# EAGLE design Printrhub_Rev_0.2 (EAGLE 7.5.0)
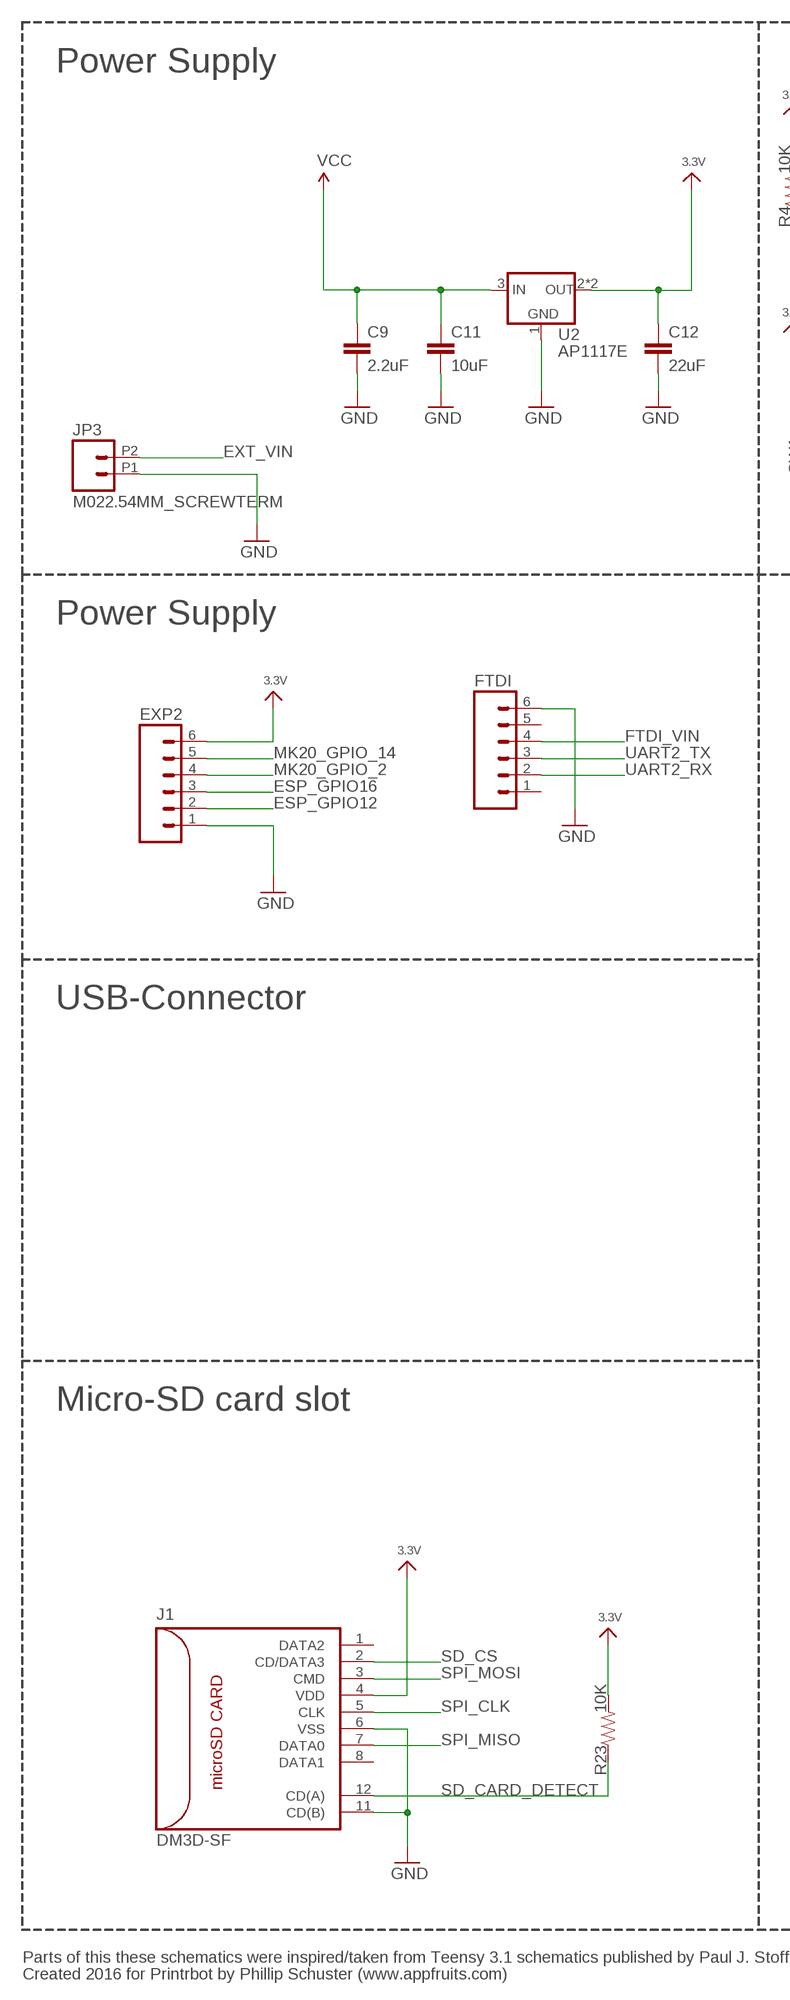
[diagram p0: schematic, sheet 1, part 1 of 2]
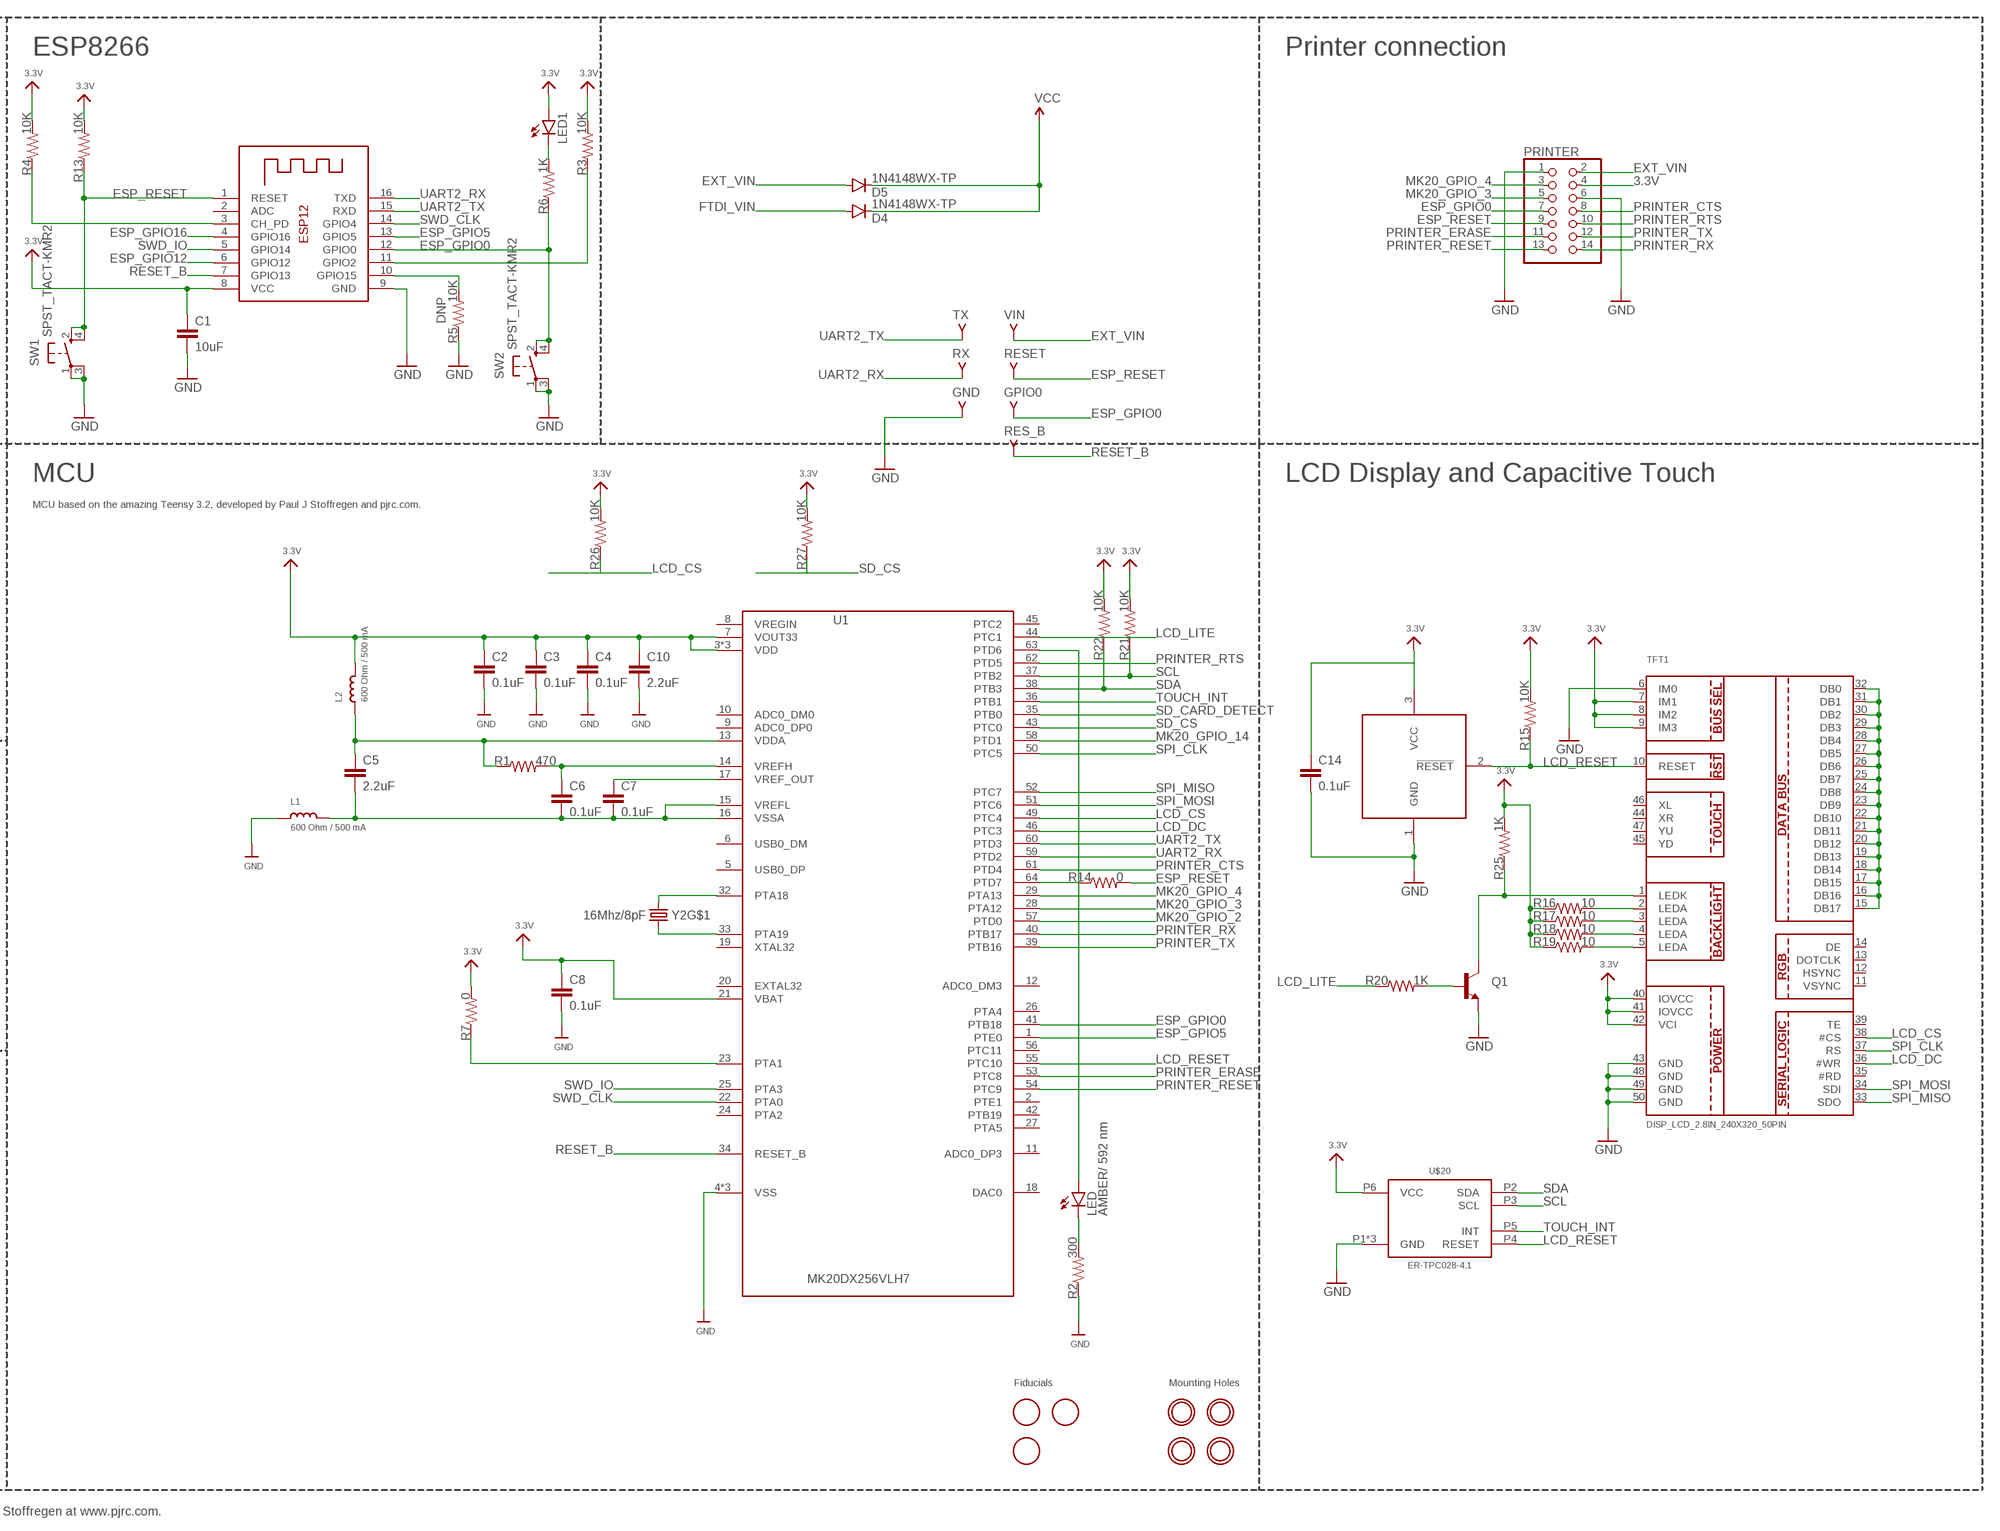
[diagram p1: schematic, sheet 1, part 2 of 2]

## Parts
C1  10uF  CAPACITOR-10UF  [0603-CAP]
C2  0.1uF  CAPACITOR-0.1UF  [0603-CAP]
C3  0.1uF  CAPACITOR-0.1UF  [0603-CAP]
C4  0.1uF  CAPACITOR-0.1UF  [0603-CAP]
C5  2.2uF  CAPACITOR-2.2UF  [0603-CAP]
C6  0.1uF  CAPACITOR-0.1UF  [0603-CAP]
C7  0.1uF  CAPACITOR-0.1UF  [0603-CAP]
C8  0.1uF  CAPACITOR-0.1UF  [0603-CAP]
C9  2.2uF  CAPACITOR-2.2UF  [0603-CAP]
C10  2.2uF  CAPACITOR-2.2UF  [0603-CAP]
C11  10uF  CAPACITOR-10UF  [0603-CAP]
C12  22uF  CAPACITOR-22UF  [0603-CAP]
C14  0.1uF  CAPACITOR-0.1UF  [0603-CAP]
D4  1N4148WX-TP  DIODESOD  [SOD-323]
D5  1N4148WX-TP  DIODESOD  [SOD-323]
EXP2  M06SMD-STRAIGHT-ALT  [1X06_SMD_STRAIGHT_ALT]
FTDI  M06SMD-STRAIGHT-ALT  [1X06_SMD_STRAIGHT_ALT]
GND  TPV-SMD-18RN  [SMD-18RN]
GPIO0  TPV-SMD-18RN  [SMD-18RN]
J1  DM3D-SF  [DM3D-SF]
JP3  M022.54MM_SCREWTERM  [1X02_2.54_SCREWTERM]
L1  600 Ohm / 500 mA  INDUCTOR-0603_600OHM/500MA  [0603]
L2  600 Ohm / 500 mA  INDUCTOR-0603_600OHM/500MA  [0603]
LED  AMBER/ 592 nm  LED-AMBER  [LED-0603]
LED1  LED-GREEN  [LED-0603]
PRINTER  PINHD-2X7SMT  [2X07_SMT]
Q1  TRANSISTOR_NPNSOT23-3  [SOT23-3]
R1  470  RESISTOR-470  [0603-RES]
R2  300  RESISTOR0603  [0603-RES]
R3  10K  RESISTOR-10K  [0603-RES]
R4  10K  RESISTOR-10K  [0603-RES]
R5  10K  RESISTOR-10K  [0603-RES]
R6  1K  RESISTOR-1K  [0603-RES]
R7  0  RESISTOR-0  [0603-RES]
R13  10K  RESISTOR-10K  [0603-RES]
R14  0  RESISTOR-0  [0603-RES]
R15  10K  RESISTOR-10K  [0603-RES]
R16  10  RESISTOR-10  [0603-RES]
R17  10  RESISTOR-10  [0603-RES]
R18  10  RESISTOR-10  [0603-RES]
R19  10  RESISTOR-10  [0603-RES]
R20  1K  RESISTOR-1K  [0603-RES]
R21  10K  RESISTOR-10K  [0603-RES]
R22  10K  RESISTOR-10K  [0603-RES]
R23  10K  RESISTOR-10K  [0603-RES]
R25  1K  RESISTOR-1K  [0603-RES]
R26  10K  RESISTOR-10K  [0603-RES]
R27  10K  RESISTOR-10K  [0603-RES]
RES_B  TPV-SMD-18RN  [SMD-18RN]
RESET  TPV-SMD-18RN  [SMD-18RN]
RX  TPV-SMD-18RN  [SMD-18RN]
SW1  SPST_TACT-KMR2  [KMR2]
SW2  SPST_TACT-KMR2  [KMR2]
TFT1  DISP_LCD_2.8IN_240X320_50PIN  [TFT_2.83IN_240X320_50PIN]
TX  TPV-SMD-18RN  [SMD-18RN]
U1  MK20DX256VLH7  [MK20DX256VLH7]
U2  AP1117E  [SOT223]
U3  MAX308-SOT23  [SOT23]
U$15  MOUNTINGHOLE2.0  [MOUNTINGHOLE_2.0_PLATED]
U$16  MOUNTINGHOLE2.0  [MOUNTINGHOLE_2.0_PLATED]
U$17  MOUNTINGHOLE2.0  [MOUNTINGHOLE_2.0_PLATED]
U$18  MOUNTINGHOLE2.0  [MOUNTINGHOLE_2.0_PLATED]
U$20  ER-TPC028-4.1  [ER-CON06HB-1]
U$38  FIDUCIAL  [FIDUCIAL_1MM]
U$39  FIDUCIAL  [FIDUCIAL_1MM]
U$40  FIDUCIAL  [FIDUCIAL_1MM]
VIN  TPV-SMD-18RN  [SMD-18RN]
X1  ESP-12  [ESP-12]
Y2  16Mhz/8pF  CRYSTAL/SMD-5X3-GND16MHZ/8PF  [CRYSTAL-SMD-5X3]

## Nets
3.3V: C1.1 C2.1 C3.1 C4.1 C8.1 C10.1 C12.1 C14.1 EXP2.6 J1.4(VDD) L2.2 LED1.A PRINTER.4 R3.2 R4.2 R7.2 R13.2 R15.2 R16.1 R17.1 R18.1 R19.1 R21.2 R22.2 R23.2 R25.2 R26.2 R27.2 TFT1.7(IM1) TFT1.8(IM2) TFT1.9(IM3) TFT1.40(IOVCC) TFT1.41(IOVCC) TFT1.42(VCI) U1.3(VDD) U1.7(VOUT33) U1.21(VBAT) U1.30(VDD) U1.48(VDD) U2.2(OUT) U2.4(OUT) U3.3(VCC) U$20.P6(VCC) X1.8(VCC)
ESP_GPIO0: GPIO0.TP PRINTER.7 R6.1 SW2.2(S) SW2.4(S1) U1.41(PTB18) X1.12(GPIO0)
ESP_GPIO5: U1.1(PTE0) X1.13(GPIO5)
ESP_GPIO12: EXP2.2 X1.6(GPIO12)
ESP_GPIO16: EXP2.3 X1.4(GPIO16)
ESP_RESET: PRINTER.9 R13.1 R14.2 RESET.TP SW1.2(S) SW1.4(S1) X1.1(RESET)
EXT_VIN: D5.A JP3.P2 PRINTER.2 VIN.TP
FTDI_VIN: D4.A FTDI.4
GND [Top GND Pour]: C1.2 C2.2 C3.2 C4.2 C8.2 C9.2 C10.2 C11.2 C12.2 C14.2 EXP2.1 FTDI.6 GND.TP J1.6(VSS) J1.11(CD(B)) JP3.P1 L1.1 PRINTER.1 PRINTER.6 Q1.2(E) R2.1 R5.1 SW1.1(P) SW1.3(P1) SW2.1(P) SW2.3(P1) TFT1.6(IM0) TFT1.43(GND) TFT1.48(GND) TFT1.49(GND) TFT1.50(GND) U1.4(VSS) U1.31(VSS) U1.47(VSS) U2.1(GND) U3.1(GND) U$20.P1(GND) U$20.PAD@0(GND) U$20.PAD@1(GND) X1.9(GND)
LCD_CS: R26.1 TFT1.38(#CS) U1.49(PTC4)
LCD_DC: TFT1.36(#WR) U1.46(PTC3)
LCD_LITE: R20.1 U1.44(PTC1)
LCD_RESET: R15.1 TFT1.10(RESET) U1.55(PTC10) U3.2(!RESET) U$20.P4(RESET)
MK20_GPIO_2: EXP2.4 U1.57(PTD0)
MK20_GPIO_3: PRINTER.5 U1.28(PTA12)
MK20_GPIO_4: PRINTER.3 U1.29(PTA13)
MK20_GPIO_14: EXP2.5 U1.58(PTD1)
N$1: R14.1 U1.64(PTD7)
N$2: R5.2 X1.10(GPIO15)
N$3: R7.1 U1.23(PTA1)
N$4: R3.1 X1.11(GPIO2)
N$5: R4.1 X1.3(CH_PD)
N$7: LED1.C R6.2
N$10: Q1.3(C) R25.1 TFT1.1(LEDK)
N$11: R16.2 TFT1.2(LEDA)
N$12: LED.A U1.63(PTD6)
N$13: R17.2 TFT1.3(LEDA)
N$14: R18.2 TFT1.4(LEDA)
N$15: R19.2 TFT1.5(LEDA)
N$16: Q1.1(B) R20.2
N$17: TFT1.15(DB17) TFT1.16(DB16) TFT1.17(DB15) TFT1.18(DB14) TFT1.19(DB13) TFT1.20(DB12) TFT1.21(DB11) TFT1.22(DB10) TFT1.23(DB9) TFT1.24(DB8) TFT1.25(DB7) TFT1.26(DB6) TFT1.27(DB5) TFT1.28(DB4) TFT1.29(DB3) TFT1.30(DB2) TFT1.31(DB1) TFT1.32(DB0)
N$18: LED.C R2.2
N$27: U1.32(PTA18) Y2.3
N$28: U1.33(PTA19) Y2.1
PRINTER_CTS: PRINTER.8 U1.61(PTD4)
PRINTER_ERASE: PRINTER.11 U1.53(PTC8)
PRINTER_RESET: PRINTER.13 U1.54(PTC9)
PRINTER_RTS: PRINTER.10 U1.62(PTD5)
PRINTER_RX: PRINTER.14 U1.40(PTB17)
PRINTER_TX: PRINTER.12 U1.39(PTB16)
RESET_B: RES_B.TP U1.34(RESET_B) X1.7(GPIO13)
SCL: R21.1 U1.37(PTB2) U$20.P3(SCL)
SD_CARD_DETECT: J1.12(CD(A)) R23.1 U1.35(PTB0)
SD_CS: J1.2(CD/DATA3) R27.1 U1.43(PTC0)
SDA: R22.1 U1.38(PTB3) U$20.P2(SDA)
SPI_CLK: J1.5(CLK) TFT1.37(RS) U1.50(PTC5)
SPI_MISO: J1.7(DATA0) TFT1.33(SDO) U1.52(PTC7)
SPI_MOSI: J1.3(CMD) TFT1.34(SDI) U1.51(PTC6)
SWD_CLK: U1.22(PTA0) X1.14(GPIO4)
SWD_IO: U1.25(PTA3) X1.5(GPIO14)
TOUCH_INT: U1.36(PTB1) U$20.P5(INT)
UART2_RX: FTDI.2 RX.TP U1.59(PTD2) X1.16(TXD)
UART2_TX: FTDI.3 TX.TP U1.60(PTD3) X1.15(RXD)
VCC: C9.1 C11.1 D4.C D5.C U2.3(IN)
VDDA: C5.1 L2.1 R1.1 U1.13(VDDA)
VREF_OUT: C7.1 U1.17(VREF_OUT)
VREFH: C6.1 R1.2 U1.14(VREFH)
VREFL: C5.2 C6.2 C7.2 L1.2 U1.15(VREFL) U1.16(VSSA)
Unconnected: FTDI.1 FTDI.5 J1.1(DATA2) J1.8(DATA1) J1.9(GND) J1.10(GND) J1.13(GND) J1.14(GND) TFT1.11(VSYNC) TFT1.12(HSYNC) TFT1.13(DOTCLK) TFT1.14(DE) TFT1.35(#RD) TFT1.39(TE) TFT1.44(XR) TFT1.45(YD) TFT1.46(XL) TFT1.47(YU) U1.2(PTE1) U1.5(USB0_DP) U1.6(USB0_DM) U1.8(VREGIN) U1.9(ADC0_DP0) U1.10(ADC0_DM0) U1.11(ADC0_DP3) U1.12(ADC0_DM3) U1.18(DAC0) U1.19(XTAL32) U1.20(EXTAL32) U1.24(PTA2) U1.26(PTA4) U1.27(PTA5) U1.42(PTB19) U1.45(PTC2) U1.56(PTC11) X1.2(ADC) Y2.2(GND:GND) Y2.4(GND:GND)

## Notes on the sheet
- Power Supply | ESP8266 | Printer connection
- DNP
- Power Supply | MCU | LCD Display and Capacitive Touch
- MCU based on the amazing Teensy 3.2, developed by Paul J Stoffregen and pjrc.com.
- USB-Connector
- Micro-SD card slot
- Fiducials | Mounting Holes
- Parts of this these schematics were inspired/taken from Teensy 3.1 schematics published by Paul J. Stoffregen at www.pjrc.com.
- Created 2016 for Printrbot by Phillip Schuster (www.appfruits.com)

## Library data of the parts
C1 C11 = appfruits:CAPACITOR; MF: Murata; MPN: GRM188R60J106ME47D
C2-C4 C6-C8 C14 = appfruits:CAPACITOR; MF: Kemet; MPN: C0603C104J3RACTU
C5 C9 C10 = appfruits:CAPACITOR; MF: Kemet; MPN: C0603C225K4PACTU
C12 = appfruits:CAPACITOR; MF: Murata; MPN: GRM188R60J226MEA0D
D4 D5 = SparkFun-DiscreteSemi:DIODE: Diode These are standard reverse protection diodes and small signal diodes. SMA package can handle up to about 1A. SOD-323 can handle about 200mA. What the SOD-323 package when ordering, there are some mfgs out there that are 5-pin packages.; MF: Micro Commercial Co; MPN: 1N4148WX-TP; PROD_ID: DIO-09646
EXP2 FTDI = appfruits:M06: Header 6 Standard 6-pin 0.1" header. Use with straight break away headers (SKU : PRT-00116), right angle break away headers (PRT-00553), swiss pins (PRT-00743), machine pins (PRT-00117), and female headers (PRT-00115). Molex polarized connector foot print use with SKU : PRT-08094 with associated crimp pins and housings. NOTES ON THE VARIANTS LOCK and LOCK_LONGPADS... This footprint was designed to help hold the alignment of a through-hole component (i.e. 6-pin header) while soldering it into place. You may notice that each hole has been shifted either up or down by 0.005 of an inch from it's more standard position (which is a perfectly straight line). This slight alteration caused the pins (the squares in the middle) to touch the edges of the holes. Because they are alternating, it causes a "brace" to hold the component in place. 0.005 has proven to be the perfect amount of "off-center" position when using our standard breakaway headers. Although looks a little odd when you look at the bare footprint, once you have a header in there, the alteration is very hard to notice. Also,if you push a header all the way into place, it is covered up entirely on the bottom side. This idea of altering the position of holes to aid alignment will be further integrated into the Sparkfun Library for other footprints. It can help hold any component with 3 or more connection pins.
GND GPIO0 RES_B RESET RX TX VIN = appfruits:TPV: TEST POINT PAD; BOM: EXCLUDE
J1 = con-sd-card:DM3D-SF: MICRO SD CONNECTOR
JP3 = SparkFun-Connectors:M02: Standard 2-pin 0.1" header. Use with - straight break away headers ( PRT-00116) - right angle break away headers (PRT-00553) - swiss pins (PRT-00743) - machine pins (PRT-00117) - female headers (PRT-00115) Molex polarized connector foot print use with: PRT-08233 with associated crimp pins and housings. 2.54_SCREWTERM for use with PRT-10571. 3.5mm Screw Terminal footprints for PRT-08084 5mm Screw Terminal footprints for use with PRT-08432
L1 L2 = appfruits:INDUCTOR: Inductors 0603: 10nH Ceramic Inductor - microwire antenna/RF (Digikey: 712-1434-2-ND) 0805: 560nH Ceramic Inductor - RF (Digikey: 553-1047-1-ND) 270nH Ceramic Inductor - Q = 40@250MHz, +-5%, 1 Ohm DC Resistance (Digikey: 535-10506-2-ND) 1007 (2518 Metric) SMT: 10µH 10% 250mOhm 820mA 1007 Inductor (Digikey: 587-2189-1-ND) 22µH 10% 500mOhm 580mA 1007 Inductor (Digikey: 587-2190-1-ND) 47µH 10% 950mOhm 420mA 1007 Inductor (Digikey: 587-2191-1-ND) 47µH 5% 100mOhm 1A 1008 Inductor (Digikey: 732-1816-1-ND) 5.0x5.0mm (Taiyo Yuden NR5040 Series) 6.8µH 20% 2.3A 64mOhm Inductor (Digikey: 587-2374-2-ND) 5.0x5.0mm (TDK VLC5045 Series) 4.7µH 20% 3.3A 34mOhm Inductor (Digikey: 445-6526-1-ND) 6.8µH 20% 2.7A 46mOhm Inductor (Digikey: 445-6527-1-ND) 6.0x6.0mm (TDK VLC6045 Series) 4.7µH 20% 3.8A 27mOhm Inductor (Digikey: 445-6538-2-ND) 6.8µH 20% 3A 41mOhm Inductor (Digikey: 445-6540-1-ND) 6.2µH 30% 2.2A 45mOhm Inductor (Digikey: SRR5028-6R2YCT-ND) - Not TDK VLC6045 but footprint should match 6.0x6.0mm (TDK SLF6045 Series) 6.8uH 30% 2A 33mOhm Inductor (Digikey: 445-4572-1-ND, Mouser: 810-SLF645T6R8N2R0PF) 6.0x6.0mm (Sumida CDRH5D28 Series) 6.2uH 30% 1.8A 45mOhm Inductor (Digikey: 308-1542-1-ND) Taiyo Yuden NR3015T2R2M - 2.2uH 20% 1.5A (Digikey: 587-1648-2-ND, Mouser: 963-NR3015T2R2M) - Used with TI TPS62172 CoilCraft RFID Transponder Coil - MA5532-AE (For use with AS3935 Lightning Sensor); MF: Murata; MPN: BLM18AG601SN1D
LED = appfruits:LED: LEDs Standard schematic elements and footprints for 5mm, 3mm, 1206, and 0603 sized LEDs. 5mm - Spark Fun Electronics SKU : COM-00529 (and others); MF: Avago Technologies; MPN: HSMA-C190
LED1 = appfruits:LED: LEDs Standard schematic elements and footprints for 5mm, 3mm, 1206, and 0603 sized LEDs. 5mm - Spark Fun Electronics SKU : COM-00529 (and others); MF: Avago; MPN: HSMG-C190
PRINTER = pinhead+:PINHD-2X7: PIN HEADER
Q1 = appfruits:TRANSISTOR_NPN: Generic NPN BJT MMBT2222A - TRANS-08049 (SOT-23, 1A 40V) MPSA42 - TRANS-09116 (SOT-23, 500mA 300V) MMBT5088LT1G - TRANS-11160 (SOT-23, 50 mA 30V) BC547 - COM-08928 <http://www.sparkfun.com/products/8928> (TO-92 45V 100mA) (1.Collector 2.Base 3.Emitter) 2N3904 - COM-00521 <http://www.sparkfun.com/products/521> (TO-92 40V 200mA) (1.Emitter 2.Base 3.Collector) P2N2222A - COM-12852 <http://www.sparkfun.com/products/12852> (TO-92 40V 600mA) (1.Collector 2.Base 3.Emitter); MF: ON Semiconductor; MPN: MMBT2222ALT1G
R1 = appfruits:RESISTOR: Resistor Basic schematic elements and footprints for 0603, 1206, and PTH resistors.; MF: Panasonic; MPN: ERJ-3GEYJ471V
R2 = appfruits:RESISTOR: Resistor Basic schematic elements and footprints for 0603, 1206, and PTH resistors.
R3-R5 R13 R15 R21-R23 R26 R27 = appfruits:RESISTOR: Resistor Basic schematic elements and footprints for 0603, 1206, and PTH resistors.; MF: Panasonic; MPN: ERJ-3GEYJ103V
R6 R20 R25 = appfruits:RESISTOR: Resistor Basic schematic elements and footprints for 0603, 1206, and PTH resistors.; MF: Panasonic; MPN: ERJ-3GEYJ102V
R7 R14 = appfruits:RESISTOR: Resistor Basic schematic elements and footprints for 0603, 1206, and PTH resistors.; MF: Panasonic; MPN: ERJ-3GEY0R00V
R16-R19 = appfruits:RESISTOR: Resistor Basic schematic elements and footprints for 0603, 1206, and PTH resistors.; MF: Panasonic; MPN: ERJ-3EKF10R0V
SW1 SW2 = adafruit:SPST_TACT: SMT 6mm switch, EVQQ2 series http://www.ladyada.net/library/eagle
TFT1 = appfruits:DISP_LCD_2.8IN_240X320_50PIN
U1 = appfruits:MK20DX256VLH7; MF: Freescale; MPN: MK20DX256VLH7
U2 = v-reg:AP1117: LDO Regulator
U3 = appfruits:MAX308: Reset Monitor for various drop voltages
U$15-U$18 = microbuilder:MOUNTINGHOLE: Mounting Hole For #2 screws (0.086"/2.18mm width, 0.094"/2.4mm hole) use 2.5mm
U$20 = appfruits:ER-TPC028-4.1: Connector for ER-TFT028-4 capacitive touch screen controller (buydisplay.com)
U$38-U$40 = adafruit:FIDUCIAL: For use by pick and place machines to calibrate the vision/machine, 1mm By microbuilder.eu
X1 = adafruit:ESP-12
Y2 = appfruits:CRYSTAL/SMD-5X3-GND; MF: ECS; MPN: ECS-160-8-30B-CKM

## Net classes
1 USB: width 0.267 mm, drill 0.33 mm, clearance 0.159 mm
2 Top GND Pour: clearance 0.762 mm to class 1

## Board
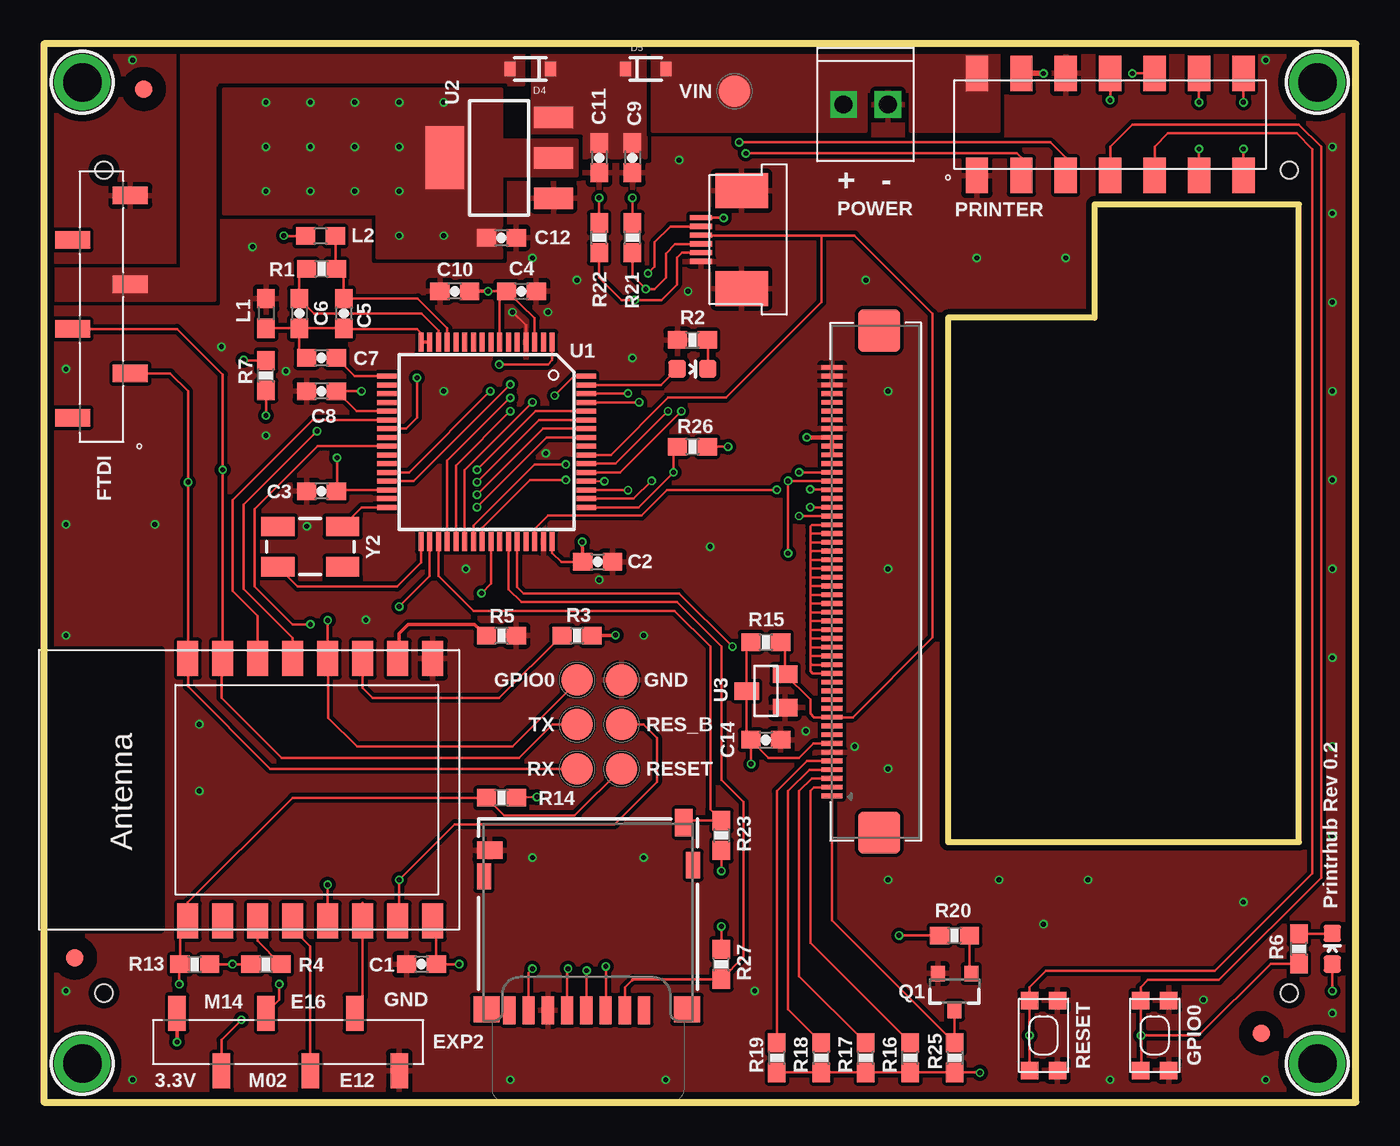
[diagram p2: board, top side]
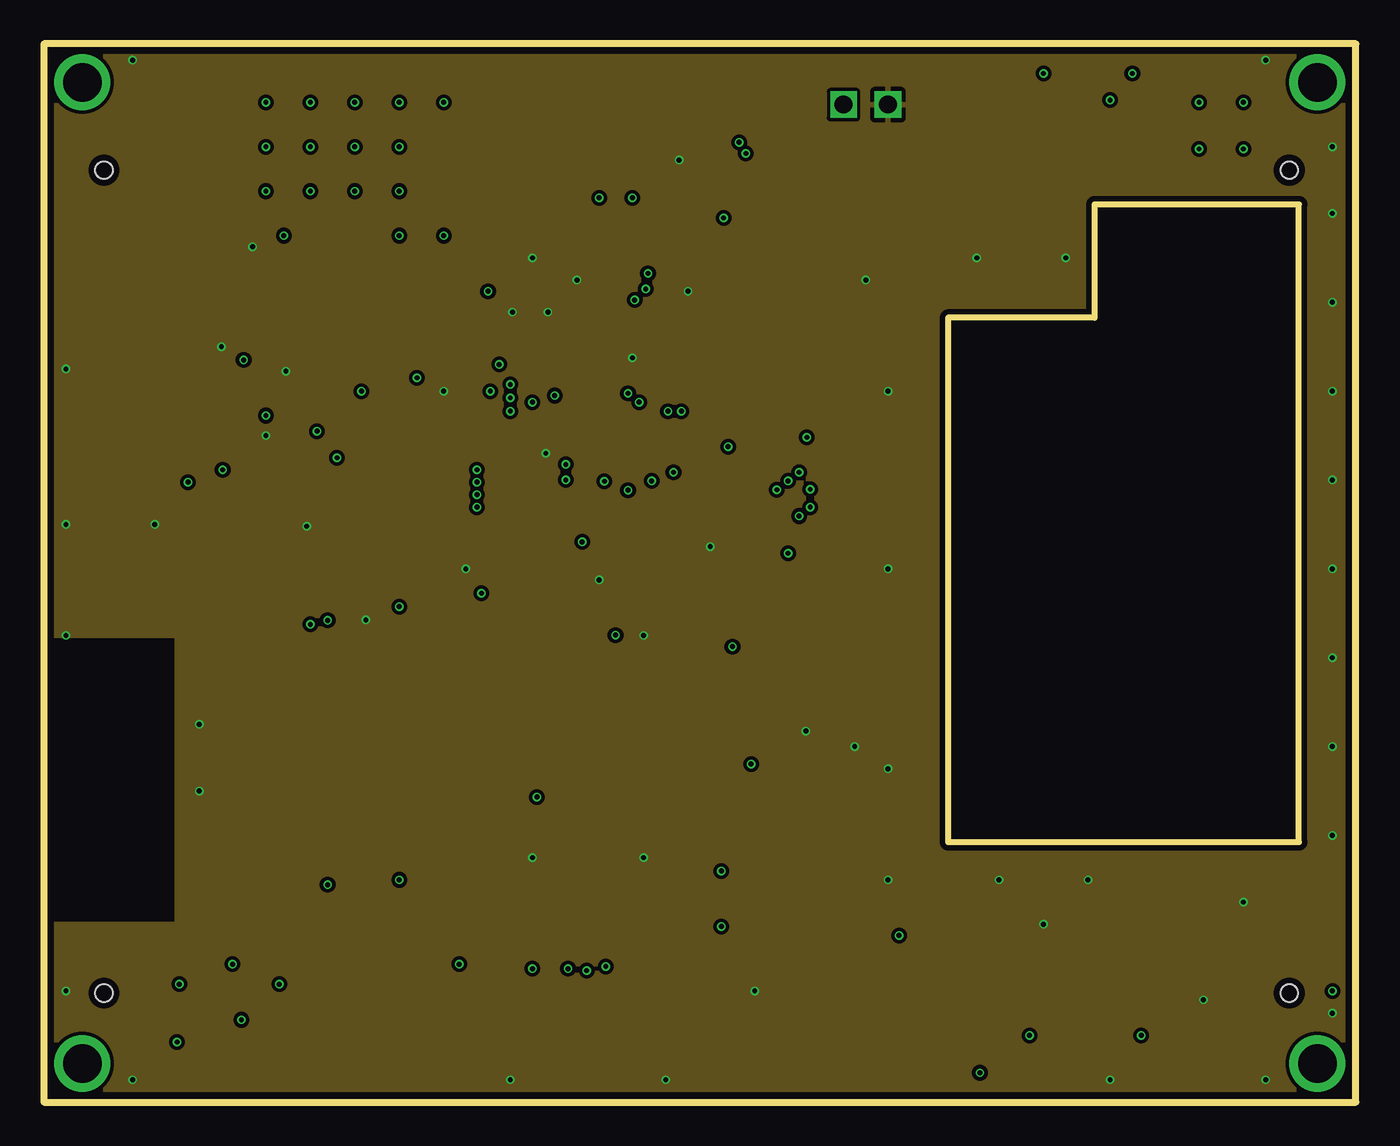
[diagram p3: board, inner layer GND]
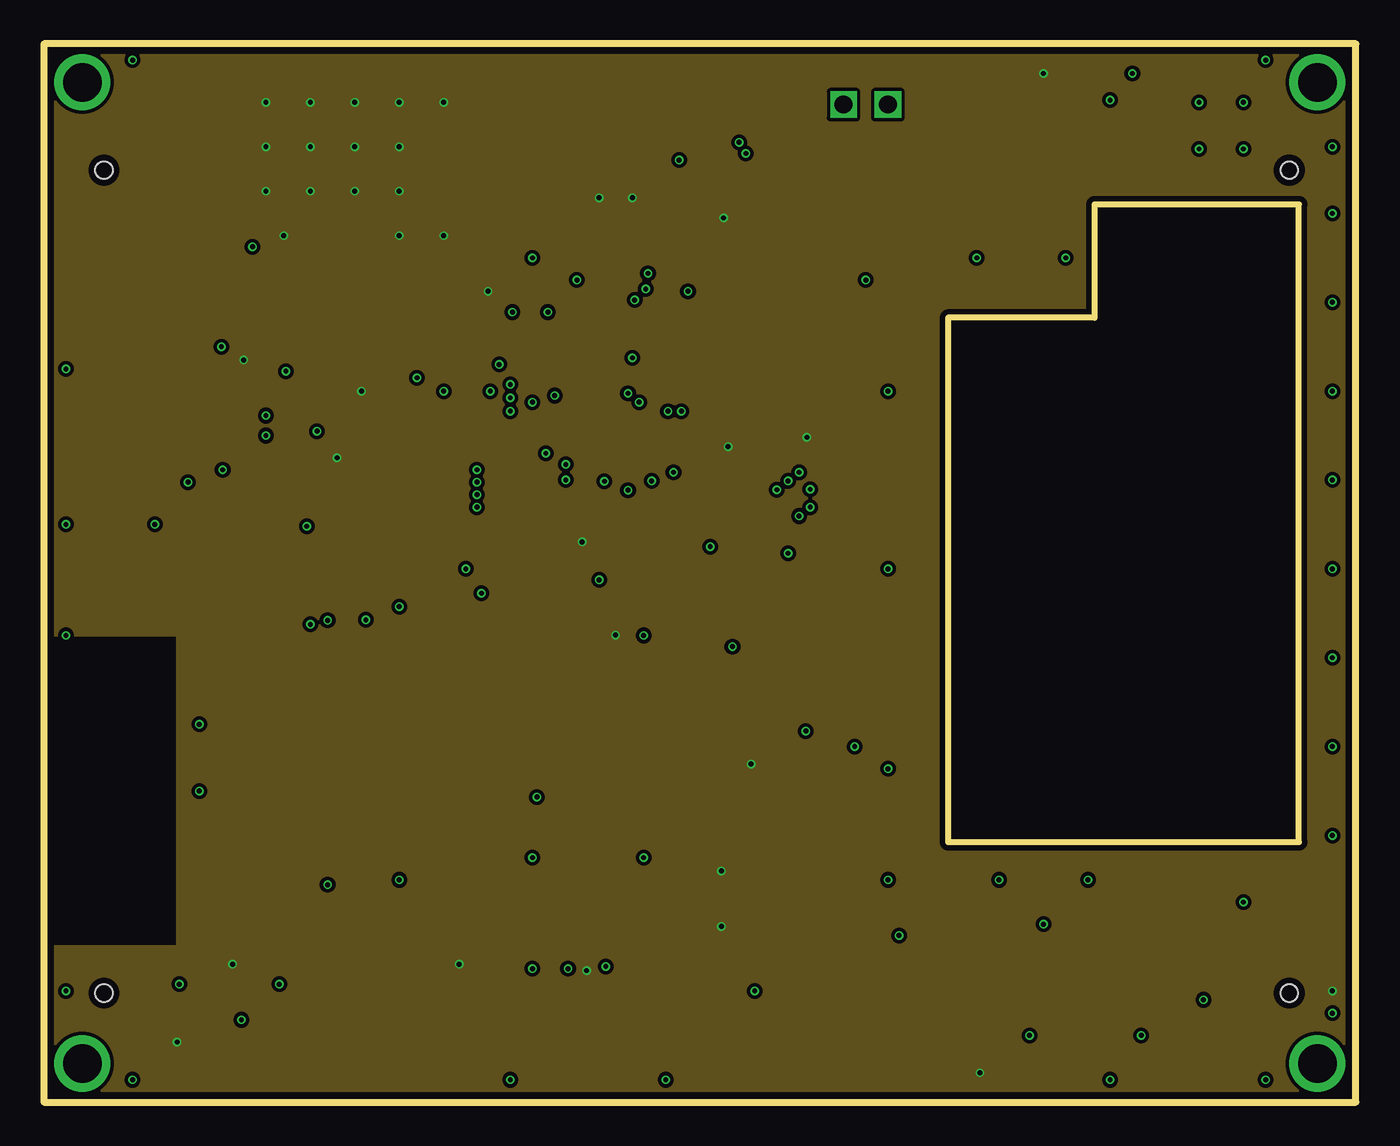
[diagram p4: board, inner layer 3V3]
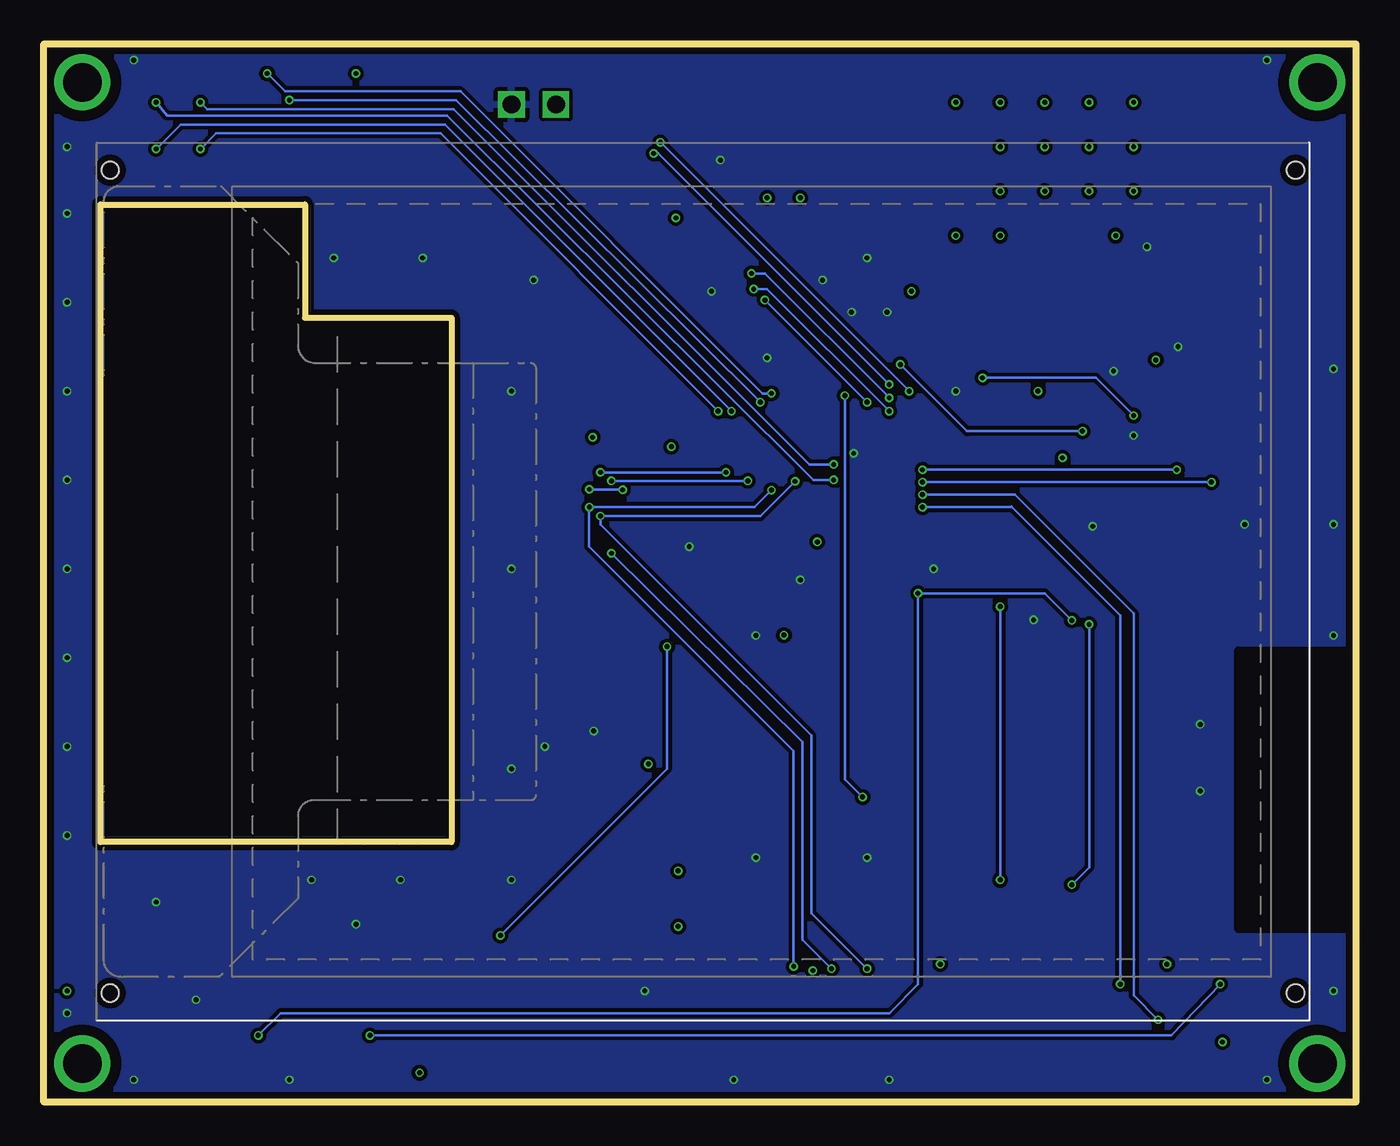
[diagram p5: board, bottom side, seen from below]

Size 75 x 60.5 mm. Coordinates in mm from the lower left corner, seen from the top.
Outline: 0,0 75,0 75,60.5 0,60.5 0,0
Outline: 51.69,14.86 71.75,14.86 71.75,51.31 60.07,51.31 60.07,44.83 51.69,44.83 51.69,14.86
Copper layers (1*2*15*16): Top 0.035559375mm / dielectric 0.17018125mm / GND 0.01778125mm / dielectric 47mil / 3V3 0.01778125mm / dielectric 0.17018125mm / Bottom 0.035559375mm
Design rules "OSHPark-4layer *": minimum track width 5mil, minimum drill 10mil, track to track 5mil, track to pad 5mil, pad to pad 5mil, via to via 5mil, smd to smd 5mil, copper to edge 15mil, drill to drill 6mil, minimum pad ring 4mil, minimum via ring 4mil, stop-mask expansion 4mil, vias tented up to drill 11mil, thermal gap 10mil
Milling: area 51.7,14.9 to 71.8,51.3

### Footprints (pad centres in the part's own frame; a part is rotated, then mirrored left to right if it is on the bottom)
0603-CAP = smd 1.1 x 1: 1 -0.85,0; 2 0.85,0
SOD-323 = smd 0.63 x 0.83: A 1.15,0; C -1.15,0
1X06_SMD_STRAIGHT_ALT = smd 1 x 2: 1 0,-1.65; 2 -2.54,1.65; 3 -5.08,-1.65; 4 -7.62,1.65; 5 -10.16,-1.65; 6 -12.7,1.65
SMD-18RN = smd 1.8 x 1.8: TP 0,0
DM3D-SF = smd 0.7 x 1.6: 1 3.2,0.8; 2 2.1,0.8; 3 1,0.8; 4 -0.1,0.8; 5 -1.2,0.8; 6 -2.3,0.8; 7 -3.4,0.8; 8 -4.5,0.8 | smd 1.5 x 1.5: 9 -5.8,0.85; 14 5.65,0.85 | smd 0.8 x 1.5: 10 -5.95,8.45; 13 6,9.1 | smd 1.45 x 1: 11 -5.625,9.95 | smd 1 x 1.55: 12 5.475,11.525
1X02_2.54_SCREWTERM = drill 1.016 square: P1 2.54,0; P2 0,0
0603 = smd 1.1 x 1: 1 -0.85,0; 2 0.85,0
LED-0603 = smd 1 x 1: A 0,-0.877; C 0,0.877
2X07_SMT = smd 1.27 x 2.032: 1 -7.62,-2.921; 2 -7.62,2.921; 3 -5.08,-2.921; 4 -5.08,2.921; 5 -2.54,-2.921; 6 -2.54,2.921; 7 0,-2.921; 8 0,2.921; 9 2.54,-2.921; 10 2.54,2.921; 11 5.08,-2.921; 12 5.08,2.921; 13 7.62,-2.921; 14 7.62,2.921
SOT23-3 = smd 0.8 x 0.9: 1 -0.95,-1; 2 0.95,-1; 3 0,1.1
0603-RES = smd 1.1 x 1: 1 -0.85,0; 2 0.85,0
KMR2 = smd 1 x 1: 1 2,0.8; 2 2,-0.8; 3 -2,0.8; 4 -2,-0.8
TFT_2.83IN_240X320_50PIN = smd 0.275 x 1.2 bottom: 1 12.25,-10.39; 2 11.75,-10.39; 3 11.25,-10.39; 4 10.75,-10.39; 5 10.25,-10.39; 6 9.75,-10.39; 7 9.25,-10.39; 8 8.75,-10.39; 9 8.25,-10.39; 10 7.75,-10.39; 11 7.25,-10.39; 12 6.75,-10.39; 13 6.25,-10.39; 14 5.75,-10.39; 15 5.25,-10.39; 16 4.75,-10.39; 17 4.25,-10.39; 18 3.75,-10.39; 19 3.25,-10.39; 20 2.75,-10.39; 21 2.25,-10.39; 22 1.75,-10.39; 23 1.25,-10.39; 24 0.75,-10.39; 25 0.25,-10.39; 26 -0.25,-10.39; 27 -0.75,-10.39; 28 -1.25,-10.39; 29 -1.75,-10.39; 30 -2.25,-10.39; 31 -2.75,-10.39; 32 -3.25,-10.39; 33 -3.75,-10.39; 34 -4.25,-10.39; 35 -4.75,-10.39; 36 -5.25,-10.39; 37 -5.75,-10.39; 38 -6.25,-10.39; 39 -6.75,-10.39; 40 -7.25,-10.39; 41 -7.75,-10.39; 42 -8.25,-10.39; 43 -8.75,-10.39; 44 -9.25,-10.39; 45 -9.75,-10.39; 46 -10.25,-10.39; 47 -10.75,-10.39; 48 -11.25,-10.39; 49 -11.75,-10.39; 50 -12.25,-10.39 | smd 2.4 x 2.4 bottom: PAD1 14.35,-13.09; PAD2 -14.35,-13.09 | hole 1: 23.52,-36.525; 23.52,31.225; -23.52,31.225; -23.52,-36.525
MK20DX256VLH7 = smd 1.1 x 0.285: 1 -5.7,3.75; 2 -5.7,3.25; 3 -5.7,2.75; 4 -5.7,2.25; 5 -5.7,1.75; 6 -5.7,1.25; 7 -5.7,0.75; 8 -5.7,0.25; 9 -5.7,-0.25; 10 -5.7,-0.75; 11 -5.7,-1.25; 12 -5.7,-1.75; 13 -5.7,-2.25; 14 -5.7,-2.75; 15 -5.7,-3.25; 16 -5.7,-3.75; 33 5.7,-3.75; 34 5.7,-3.25; 35 5.7,-2.75; 36 5.7,-2.25; 37 5.7,-1.75; 38 5.7,-1.25; 39 5.7,-0.75; 40 5.7,-0.25; 41 5.7,0.25; 42 5.7,0.75; 43 5.7,1.25; 44 5.7,1.75; 45 5.7,2.25; 46 5.7,2.75; 47 5.7,3.25; 48 5.7,3.75 | smd 0.285 x 1.1: 17 -3.75,-5.7; 18 -3.25,-5.7; 19 -2.75,-5.7; 20 -2.25,-5.7; 21 -1.75,-5.7; 22 -1.25,-5.7; 23 -0.75,-5.7; 24 -0.25,-5.7; 25 0.25,-5.7; 26 0.75,-5.7; 27 1.25,-5.7; 28 1.75,-5.7; 29 2.25,-5.7; 30 2.75,-5.7; 31 3.25,-5.7; 32 3.75,-5.7; 49 3.75,5.7; 50 3.25,5.7; 51 2.75,5.7; 52 2.25,5.7; 53 1.75,5.7; 54 1.25,5.7; 55 0.75,5.7; 56 0.25,5.7; 57 -0.25,5.7; 58 -0.75,5.7; 59 -1.25,5.7; 60 -1.75,5.7; 61 -2.25,5.7; 62 -2.75,5.7; 63 -3.25,5.7; 64 -3.75,5.7
SOT223 = smd 1.219 x 2.235: 1 -2.311,-3.099; 2 0,-3.099; 3 2.311,-3.099 | smd 3.6 x 2.2: 4 0,3.099
SOT23 = smd 1 x 1.4: 1 -0.95,-1.1; 2 0.95,-1.1; 3 0,1.1
MOUNTINGHOLE_2.0_PLATED = drill 2.2 pad 3: P$1 0,0
ER-CON06HB-1 = smd 0.3 x 1.25: P1 -1.25,0; P2 -0.75,0; P3 -0.25,0; P4 0.25,0; P5 0.75,0; P6 1.25,0 | smd 2 x 3: PAD@0 -2.79,-2.325; PAD@1 2.79,-2.325
FIDUCIAL_1MM = smd 1 x 1: 1 0,0
ESP-12 = smd 2 x 1.2: 1 -7.5,4.5; 2 -7.5,2.5; 3 -7.5,0.5; 4 -7.5,-1.5; 5 -7.5,-3.5; 6 -7.5,-5.5; 7 -7.5,-7.5; 8 -7.5,-9.5; 9 7.5,-9.5; 10 7.5,-7.5; 11 7.5,-5.5; 12 7.5,-3.5; 13 7.5,-1.5; 14 7.5,0.5; 15 7.5,2.5; 16 7.5,4.5
CRYSTAL-SMD-5X3 = smd 1.9 x 1.1: 1 -1.85,-1.15; 2 1.85,-1.15; 3 1.85,1.15; 4 -1.85,1.15

### Placement (x,y rotation side)
C1  21.59,7.87 180 top
C2  31.67,30.88 0 top
C3  15.88,34.92 180 top
C4  27.3,46.35 0 top
C5  17.14,45.09 270 top
C6  14.61,45.09 270 top
C7  15.88,42.55 180 top
C8  15.88,40.64 180 top
C9  33.66,53.98 270 top
C10  23.5,46.35 180 top
C11  31.75,53.98 270 top
C12  26.16,49.4 0 top
C14  41.27,20.7 0 top
D4  27.81,59.05 180 top
D5  34.42,59.05 0 top
EXP2  20.32,3.43 0 top
FTDI  3.3,39.12 270 top
GND  33.02,24.13 0 top
GPIO0  30.48,24.13 0 top
J1  31.11,4.45 0 top
JP3  45.72,57.02 0 top
L1  12.7,45.09 270 top
L2  15.83,49.51 180 top
LED  37.08,41.91 270 top
LED1  73.66,8.76 0 top
PRINTER  60.96,55.88 0 top
Q1  52.07,6.35 180 top
R1  15.88,47.62 180 top
R2  37.08,43.56 0 top
R3  30.48,26.67 0 top
R4  12.7,7.87 180 top
R5  26.16,26.67 180 top
R6  71.75,8.76 90 top
R7  12.7,41.53 90 top
R13  8.64,7.87 0 top
R14  26.16,17.4 180 top
R15  41.27,26.29 180 top
R16  49.53,2.54 90 top
R17  46.99,2.54 90 top
R18  44.45,2.54 90 top
R19  41.91,2.54 90 top
R20  52.07,9.53 0 top
R21  33.66,49.4 90 top
R22  31.75,49.4 90 top
R23  38.73,15.24 270 top
R25  52.07,2.54 270 top
R26  37.08,37.47 0 top
R27  38.73,7.87 90 top
RES_B  33.02,21.59 0 top
RESET  33.02,19.05 0 top
RX  30.48,19.05 0 top
SW1  57.15,3.81 270 top
SW2  63.5,3.81 270 top
TFT1  34.67,29.75 270 bottom
TX  30.48,21.59 0 top
U1  25.32,37.74 270 top
U2  26.04,53.98 90 top
U3  41.27,23.5 90 top
U$15  2.2,58.3 0 top
U$16  72.8,58.3 0 top
U$17  2.2,2.2 0 top
U$18  72.8,2.2 0 top
U$20  37.56,49.3 90 top
U$38  1.78,8.26 0 top
U$39  5.71,57.91 0 top
U$40  69.6,3.94 0 top
VIN  39.5,57.78 0 top
X1  12.73,17.85 90 top
Y2  15.24,31.75 0 top

### Tracks (layer width: path | path; a pad name or v marks a point on that pad's centre or on a via)
3.3V  (via drill 0.28)
  Top 0.152: v25.4,46.35 C4.1 | U1.48 29.07,31.38 29.59,30.86 30.8,30.86 C2.1 | U1.7 26.07,45.94 C4.1 | U1.3 28.07,44.81 C4.1 | U1.21 17.88,39.49 C8.1 v18.16,40.64 | U1.30 16.79,34.99 C3.1 16.76,34.96 v16.76,36.83 | C14.1 40.17,20.32 U3.3 40.17,26.04 R15.2 | TFT1.9 TFT1.8 TFT1.7 43.99,20.5 43.18,19.68 41.44,19.68 C14.1 | LED1.A v73.66,6.35 | U$20.P6 37.6,50.55 v38.86,50.55 | L2.2 13.74,49.51 v13.72,49.53 | v40.43,19.32 40.43,20.69 C14.1 | R23.2 v38.73,13.21 38.73,13.15 | v53.51,1.67 53.5,1.69 R25.2 R16.1 R17.1 R18.1 R19.1 | v23.75,7.87 C1.1 22.44,10.14 X1.8 | R13.2 v10.79,7.87 R4.2 | J1.4 31.02,7.49 v31.04,7.51 | R27.2 v38.73,10.03 | R26.2 v39.12,37.47 | 43.65,38 v43.62,38 | R22.2 v31.75,51.69 | R21.2 v33.66,51.69 | R7.2 11.47,42.38 v11.43,42.42
  Top 0.203: C2.1 v30.78,32.02 | C10.1 v25.4,46.35 | EXP2.6 v7.62,3.43 | R3.2 32.66,26.67 v32.69,26.69
  Top 0.254: TFT1.40 TFT1.41 TFT1.42 43.65,38
  Top 0.305: PRINTER.4 v57.15,58.8
  other vias: 22.86,49.53 20.32,57.15 22.86,57.15 20.32,54.61 17.78,57.15 15.24,57.15 12.7,57.15 12.7,54.61 15.24,54.61 17.78,54.61 20.32,52.07 17.78,52.07 15.24,52.07 12.7,52.07 20.32,49.53
  pour Top (isolate 0.254, no thermals): 10.29,57.91 26.16,57.91 26.16,54.99 30.48,54.99 30.48,52.96 26.16,52.96 26.16,48.26 19.05,48.26 19.05,50.8 10.29,50.8
  pour 3V3 (isolate 0.203): 0,0 75,0 75,60.5 0,60.5 0,26.67 7.62,26.67 7.62,8.89 0,8.89
ESP_GPIO0  (via drill 0.28)
  Top 0.152: v62.74,3.81 62.74,1.85 SW2.2 | v62.74,3.81 62.7,3.85 SW2.4 62.7,6.57 63.12,6.99 67.18,6.99 73.03,12.83 73.03,54.61 71.75,55.88 62.23,55.88 60.96,54.61 PRINTER.7 | X1.12 v16.23,27.53 | v25.02,29.08 25.57,29.63 U1.41 | v62.74,3.81 66.04,3.81 70.14,7.91 R6.1 | 16.26,25.32 16.26,21.97 17.91,20.32 26.8,20.32 30.48,24
  Top 0.203: 16.26,25.32 X1.12 | GPIO0.TP 30.48,24
  Bottom 0.152: v62.74,3.81 61.47,5.08 26.67,5.08 25.02,6.73 v25.02,29.08 17.78,29.08 v16.23,27.53
ESP_GPIO5  (via drill 0.28)
  Top 0.152: U1.1 29.07,42.41 28.83,42.16 v26.04,42.16 | X1.13 14.23,26.54 11.43,29.34 11.43,34.16 v15.62,38.35
  Bottom 0.152: v15.62,38.35 22.23,38.35 v26.04,42.16
ESP_GPIO12
  Top 0.152: 18.23,11.37 X1.6 18.23,6.04 EXP2.2
ESP_GPIO16
  Top 0.152: X1.4 14.23,9.9 15.24,8.89 EXP2.3
ESP_RESET  (via drill 0.28)
  Top 0.152: X1.1 8.23,11.4 14.22,17.4 R14.2 26.33,16.38 30.35,16.38 RESET.TP | 7.98,10.35 X1.1 | SW1.2 v56.35,3.81 SW1.4 56.35,6.57 57.28,7.49 66.93,7.49 72.52,13.08 72.52,54.48 71.63,55.37 64.26,55.37 63.5,54.61 PRINTER.9 | v7.75,6.73 7.75,7.83 R13.1 7.79,9.91 X1.1
  Bottom 0.152: v56.35,3.81 10.54,3.81 v7.75,6.73
EXT_VIN
  pour Top (isolate 0.254, no thermals): 34.8,55.5 34.8,60.07 54.61,60.07 54.61,55.5 49.53,55.5 49.53,57.78 46.99,57.78 46.99,55.5
FTDI_VIN
  pour Top (isolate 0.254, rank 2, no thermals): 0.64,47.62 7.87,47.62 7.87,60.07 27.43,60.07 27.43,58.17 9.78,58.17 9.78,45.85 0.64,45.85
GND  (via drill 0.28)
  Top 0.152: U1.4 27.57,44.41 v26.79,45.16
  other vias: 24.13,30.48 15.03,32.91 1.27,26.67 18.41,27.56 12.7,38.1 13.84,41.78 36.83,46.35 46.35,20.32 43.56,21.21 30.48,46.99 11.94,48.9 28.83,45.16 1.27,33.02 10.16,43.18 6.35,33.02 1.27,41.91 8.89,21.59 8.89,17.78 1.27,6.35 5.08,1.27 26.67,1.27 35.56,1.27 60.96,1.27 69.85,1.27 73.66,5.08 68.58,11.43 73.66,15.24 73.66,20.32 73.66,25.4 73.66,30.48 73.66,35.56 73.66,40.64 73.66,45.72 73.66,50.8 73.66,54.61 69.85,59.56 5.08,59.56 58.42,48.26 53.34,48.26 46.99,46.99 48.26,40.64 48.26,30.48 48.26,19.05 38.1,31.75 33.66,42.55 22.86,40.64 28.7,37.08 57.15,10.16 48.26,12.7 54.61,12.7 59.69,12.7 36.32,53.85 34.29,26.67 31.75,29.84 34.29,13.97 27.94,13.97 40.64,6.35 27.94,48.26 66.29,5.84
  pour Top (isolate 0.203, rank 4): 0,0 75,0 75,60.5 0,60.5
  pour GND (isolate 0.203): 0,0 75,0 75,60.5 0,60.5 0,26.67 7.62,26.67 7.62,10.16 0,10.16
  pour Bottom (isolate 0.203): 0,0 75,0 75,60.5 0,60.5
LCD_CS  (via drill 0.28)
  Top 0.152: U1.49 33.99,33.99 v36,36 36,37.23 R26.1 | TFT1.38 v43.18,36
  Bottom 0.152: v43.18,36 v36,36
LCD_DC  (via drill 0.28)
  Top 0.152: U1.46 28.07,32.77 28.83,33.53 34.16,33.53 35.63,35 v41.91,35 | v43.81,35.03 45.03,35.03 TFT1.36
  Bottom 0.152: v41.91,35 43.81,35 v43.81,35.03
LCD_LITE  (via drill 0.28)
  Top 0.152: U1.44 27.07,29.45 27.43,29.08 36.32,29.08 v39.37,26.04 | v48.9,9.53 R20.1
  Bottom 0.152: v39.37,26.04 39.37,19.05 v48.9,9.53
LCD_RESET
  Top 0.152: U$20.P4 37.58,49.53 44.45,49.53 | 44.45,49.53 46.35,49.53 50.8,45.09 50.8,26.54 46.26,22 TFT1.10 44.04,22 43.81,22.23 43.81,23 U3.2 42.38,26.04 R15.1 | U1.55 32.42,36.99 35.69,40.26 38.99,40.26 44.45,45.72 44.45,49.53
MK20_GPIO_2  (via drill 0.28)
  Top 0.152: U1.57 28.74,37.99 v24.77,34.01 | 12.7,5.33 EXP2.4 13.46,5.84 v13.46,6.73
  Bottom 0.152: v13.46,6.73 13.46,27.81 19.68,34.04 19.71,34.01 v24.77,34.01
MK20_GPIO_3  (via drill 0.28)
  Top 0.152: U1.28 20.88,35.99 v25.53,40.64 | v39.75,54.86 57.53,54.86 58.42,53.98 PRINTER.5
  Bottom 0.152: v25.53,40.64 v39.75,54.86
MK20_GPIO_4  (via drill 0.28)
  Top 0.152: U1.29 21.14,35.49 v26.67,41.02 | v40.13,54.23 55.63,54.23 55.88,53.98 PRINTER.3
  Bottom 0.152: v26.67,41.02 39.88,54.23 v40.13,54.23
MK20_GPIO_14  (via drill 0.28)
  Top 0.152: U1.58 28.53,38.49 v24.77,34.72 | v11.3,4.7 10.16,3.56 EXP2.5
  Bottom 0.152: v24.77,34.72 19.48,34.72 12.7,27.94 12.7,6.1 v11.3,4.7
N$1  (via drill 0.28)
  Top 0.152: U1.64 30.31,41.49 v29.21,40.39 | v28.19,17.44 R14.1
  Bottom 0.152: v28.19,17.44 29.21,18.45 v29.21,40.39
N$2
  Top 0.152: 20.11,25.48 X1.10
  Top 0.203: R5.2 24.64,27.3 20.83,27.3 20.32,26.8 20.32,25.44 X1.10
N$3  (via drill 0.28)
  Top 0.152: U1.23 20.71,38.49 21.34,39.12 v21.34,41.4 | v12.7,39.24 R7.1
  Bottom 0.152: v21.34,41.4 14.86,41.4 v12.7,39.24
N$4
  Top 0.152: X1.11 18.23,23.68 18.8,23.11 26.04,23.11 R3.1
N$5
  Top 0.152: R4.1 12.23,9.22 X1.3
N$7
  Top 0.152: R6.2 73.63,9.61 LED1.C
N$10
  Top 0.152: TFT1.1 45.06,10.4 R25.1 Q1.3
N$11
  Top 0.152: TFT1.2 44.03,18 43.81,17.78 43.81,9.11 R16.2
N$12
  Top 0.152: U1.63 35.29,40.99 LED.A
N$13
  Top 0.152: TFT1.3 43.9,18.5 43.18,17.78 43.18,7.2 R17.2
N$14
  Top 0.152: TFT1.4 43.77,19 42.55,17.78 42.55,5.29 R18.2
N$15
  Top 0.152: TFT1.5 43.63,19.5 41.91,17.78 R19.2
N$16
  Top 0.152: R20.2 52.92,7.45 Q1.1
N$17
  Top 0.152: TFT1.32 43.92,33 43.81,32.89 43.81,32.38 | 43.81,32.38 43.81,31.95 | 43.81,31.95 43.81,31.42 | 43.81,31.42 43.81,30.96 | 43.81,30.96 43.81,30.4 | 43.81,30.4 43.81,29.97 | 43.81,29.97 43.81,29.49 | 43.81,29.49 43.81,28.93 | 43.81,28.93 43.81,28.47 | 43.81,28.47 43.81,27.96 | 43.81,27.96 43.81,27.53 | 43.81,27.53 43.81,27 | 43.81,27 43.81,26.49 | 43.81,26.49 43.81,25.98 | 43.81,25.98 43.81,25.5 | 43.81,25.5 43.81,25.09 | 43.81,25.09 43.81,24.64 43.94,24.51 45.05,24.51 TFT1.15 | TFT1.31 43.93,32.5 43.81,32.38 | TFT1.30 43.86,32 43.81,31.95 | TFT1.29 43.9,31.5 43.81,31.42 | TFT1.28 43.85,31 43.81,30.96 | TFT1.27 43.91,30.5 43.81,30.4 | TFT1.26 43.84,30 43.81,29.97 | TFT1.25 43.83,29.5 43.81,29.49 | TFT1.24 43.88,29 43.81,28.93 | TFT1.23 43.84,28.5 43.81,28.47 | TFT1.22 43.85,28 43.81,27.96 | TFT1.21 43.85,27.5 43.81,27.53 | TFT1.20 43.81,27 | 43.81,27 | TFT1.19 43.82,26.5 43.81,26.49 | TFT1.18 43.83,26 43.81,25.98 | TFT1.17 43.82,25.5 43.81,25.5 | TFT1.16 43.91,25 43.81,25.09
N$18
  Top 0.152: 38.14,41.91 LED.C 37.96,43.53 R2.2
N$27
  Top 0.152: U1.32 18.18,33.99 Y2.3
N$28
  Top 0.152: U1.33 21.57,30.84 20.19,29.46 14.53,29.46 Y2.1
PRINTER_CTS  (via drill 0.28)
  Top 0.152: U1.61 34.02,39.99 v34.04,40.01 | v60.96,57.28 PRINTER.8
  Bottom 0.152: v34.04,40.01 51.44,57.28 v60.96,57.28
PRINTER_ERASE  (via drill 0.28)
  Top 0.152: U1.53 32.94,35.99 v36.45,39.5 | v66.04,54.48 PRINTER.11
  Bottom 0.152: v36.45,39.5 52.32,55.37 65.15,55.37 v66.04,54.48
PRINTER_RESET  (via drill 0.28)
  Top 0.152: U1.54 32.68,36.49 v35.69,39.5 | v68.58,54.48 PRINTER.13
  Bottom 0.152: v35.69,39.5 52.07,55.88 67.18,55.88 v68.58,54.48
PRINTER_RTS  (via drill 0.28)
  Top 0.152: U1.62 33.38,40.49 v33.4,40.51 | v62.23,58.8 PRINTER.10
  Bottom 0.152: v33.4,40.51 33.91,40.51 51.18,57.78 61.21,57.78 v62.23,58.8
PRINTER_RX  (via drill 0.28)
  Top 0.152: U1.40 25.07,32.82 27.81,35.56 v29.84,35.56 | v68.58,57.15 PRINTER.14
  Bottom 0.152: v29.84,35.56 30.99,35.56 51.94,56.39 67.94,56.39 v68.58,57.15
PRINTER_TX  (via drill 0.28)
  Top 0.152: U1.39 24.57,32.95 28.07,36.45 v29.84,36.45 | v66.04,57.15 PRINTER.12
  Bottom 0.152: v29.84,36.45 31.24,36.45 51.56,56.77 65.66,56.77 v66.04,57.15
RESET_B  (via drill 0.28)
  Top 0.152: X1.7 20.32,10.44 v20.32,12.7 23.5,15.88 32.64,15.88 35.05,18.29 35.05,20.83 34.29,21.59 RES_B.TP | U1.34 22.07,30.07 v20.32,28.32
  Bottom 0.152: v20.32,28.32 v20.32,12.7
SCL  (via drill 0.28)
  Top 0.152: U$20.P3 36.1,49.05 35.56,48.51 35.56,47.12 34.92,46.48 v34.42,46.48 33.66,47.24 R21.1 | U1.37 23.57,36.4 v26.67,39.5
  Bottom 0.152: v26.67,39.5 33.66,46.48 v34.42,46.48
SD_CARD_DETECT
  Top 0.152: J1.12 36.71,16.09 R23.1 38.1,16.73 38.1,26.04 36.07,28.07 24.57,28.07 22.57,30.07 U1.35
SD_CS
  Top 0.152: J1.2 33.22,6.54 33.66,6.99 | U1.43 26.57,29.31 27.3,28.57 36.2,28.57 38.73,26.04 38.73,18.41 40.01,17.14 40.01,8.29 R27.1 33.69,7.02
  Top 0.203: 33.66,6.99 33.69,7.02
SDA  (via drill 0.28)
  Top 0.152: U$20.P2 36.49,48.55 36.2,48.26 36.2,46.74 35.31,45.85 v33.78,45.85 33.02,45.85 31.75,47.12 R22.1 | U1.38 24.07,36.13 v27.94,40.01
  Bottom 0.152: v27.94,40.01 v33.78,45.85
SPI_CLK  (via drill 0.28)
  Top 0.152: U1.50 33.73,34.49 v34.75,35.51 | J1.5 29.91,7.56 v29.97,7.62 | v42.55,31.37 v42.55,35.51 42.5,35.5 TFT1.37
  Bottom 0.152: v34.75,35.51 v42.55,35.51 | v29.97,7.62 31.62,9.27 31.62,20.57 v42.55,31.37
SPI_MISO  (via drill 0.28)
  Top 0.152: TFT1.33 v43.18,33.5 | U1.52 v32.05,35.48 | J1.7 27.71,7.39 v27.94,7.62
  Bottom 0.152: v32.05,35.48 34.04,33.5 v43.18,33.5 43.18,33.02 31.11,20.95 31.11,10.79 v27.94,7.62
SPI_MOSI  (via drill 0.28)
  Top 0.152: TFT1.34 43.83,34 v43.81,34.01 | U1.51 33.39,34.99 v33.4,34.98 | v32.13,7.75 32.13,5.26 J1.3
  Bottom 0.152: v33.4,34.98 34.37,34.01 v43.81,34.01 43.81,31.75 32.13,20.07 v32.13,7.75
SWD_CLK
  Top 0.152: X1.14 12.23,27.77 10.79,29.21 10.79,34.42 15.37,38.99 U1.22
SWD_IO  (via drill 0.28)
  Top 0.152: U1.25 15.65,37.49 12.06,33.91 12.06,29.46 14.22,27.3 v15.24,27.3 | v16.23,12.42 X1.5
  Bottom 0.152: v15.24,27.3 15.24,13.41 v16.23,12.42
TOUCH_INT  (via drill 0.28)
  Top 0.152: U$20.P5 35.83,50.05 34.92,49.15 34.92,47.75 v34.54,47.37 | U1.36 23.07,36.66 v26.67,40.26
  Bottom 0.152: v26.67,40.26 33.78,47.37 v34.54,47.37
UART2_RX  (via drill 0.28)
  Top 0.152: U1.59 28.32,38.99 v24.77,35.43 | X1.16 8.26,25.38 v8.26,35.43 8.26,40.64 7.24,41.66 FTDI.2 | 8.26,25.32 8.26,23.75 12.95,19.05 RX.TP
  Top 0.203: 8.26,25.32 X1.16
  Bottom 0.152: v24.77,35.43 v8.26,35.43
UART2_TX  (via drill 0.28)
  Top 0.152: U1.60 28.11,39.49 v24.77,36.14 | X1.15 v10.23,36.14 10.23,41.59 7.62,44.2 FTDI.3 | TX.TP 29.08,21.59 27.18,19.68 13.59,19.68 10.16,23.11 10.16,25.28
  Top 0.203: 10.16,25.28 X1.15
  Bottom 0.152: v24.77,36.14 v10.23,36.14
VCC
  pour Top (isolate 0.254, rank 2, no thermals): 27.94,60.07 34.42,60.07 34.42,53.98 30.61,53.98 30.61,55.24 27.94,55.24
VDDA
  Top 0.152: U1.13 23.07,44.24 21.38,45.94 C5.1 17.14,47.2 R1.1 16.68,47.67 L2.1
VREF_OUT
  Top 0.152: U1.17 17.78,41.49 C7.1
VREFH
  Top 0.152: U1.14 22.57,44.1 21.59,45.09 15.46,45.09 C6.1 14.61,47.2 R1.2
VREFL
  Top 0.152: U1.16 21.57,43.96 21.34,44.2 17.18,44.2 C5.2 C6.2 | C6.2 L1.2 | C6.2 14.61,42.97 C7.2
  Top 0.203: U1.15 U1.16

### Text on the board
tPlace: + | - | ° | POWER | ° | Printrhub Rev 0.2 | M14 | E16 | GND | RESET | GPIO0 | 3.3V | M02 | E12